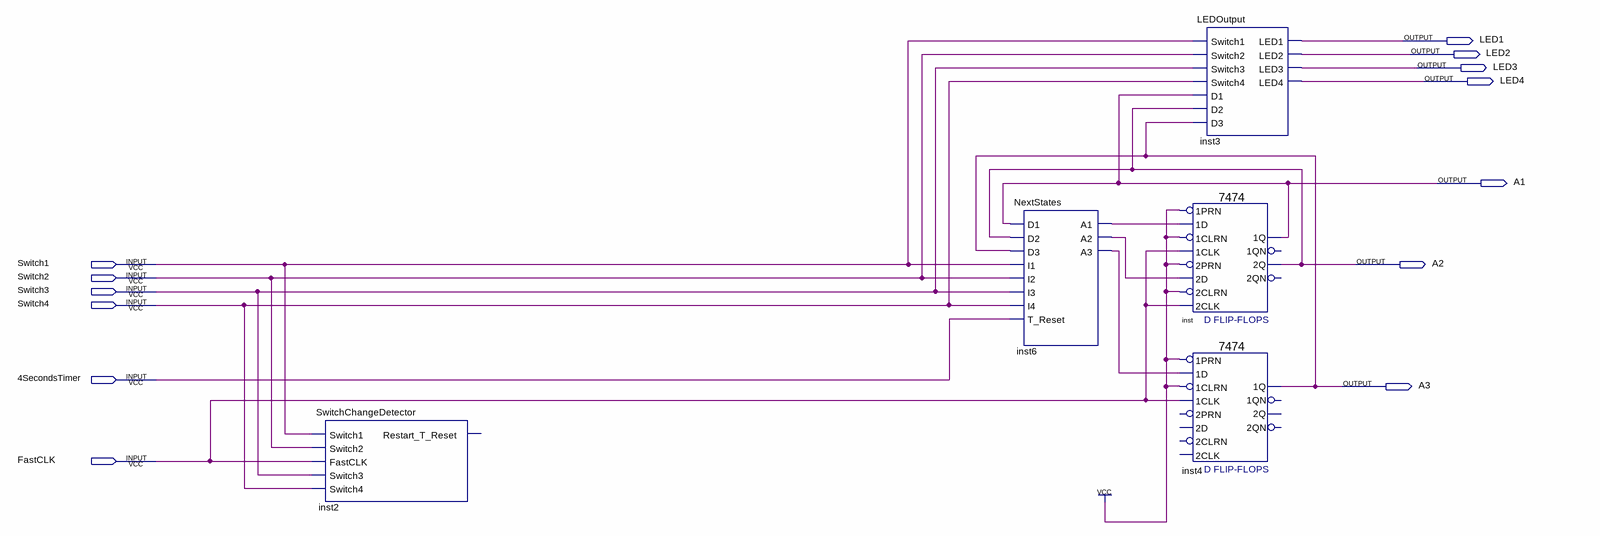
[diagram p0: schematic sheet]
// Quartus schematic ProjectQuartus.bdf as structural Verilog: 5 symbols, 13 pins
module ProjectQuartus (
  input  Switch1,
  input  Switch2,
  input  Switch3,
  input  Switch4,
  input  \4SecondsTimer ,
  input  FastCLK,
  output LED1,
  output LED2,
  output LED3,
  output LED4,
  output A1,
  output A2,
  output A3
);

  wire inst6_a1, inst6_a2, inst6_a3;

  SwitchChangeDetector inst2 (
    .Switch1(Switch1), .Switch2(Switch2), .FastCLK(FastCLK), .Switch3(Switch3), .Switch4(Switch4));  // open: Restart_T_Reset
  NextStates inst6 (
    .D1(A1), .D2(A2), .D3(A3), .I1(Switch1), .I2(Switch2), .I3(Switch3), .I4(Switch4),
    .T_Reset(\4SecondsTimer ), .A1(inst6_a1), .A2(inst6_a2), .A3(inst6_a3));
  LEDOutput inst3 (
    .Switch1(Switch1), .Switch2(Switch2), .Switch3(Switch3), .Switch4(Switch4), .D1(A1), .D2(A2), .D3(A3),
    .LED1(LED1), .LED2(LED2), .LED3(LED3), .LED4(LED4));
  \7474  inst (
    .\2D (inst6_a2), .\2PRN (1'b1), .\1CLK (FastCLK), .\1D (inst6_a1), .\1PRN (1'b1), .\2CLK (FastCLK),
    .\2CLRN (1'b1), .\1CLRN (1'b1), .\2Q (A2), .\1Q (A1));  // open: 1QN, 2QN
  \7474  inst4 (
    .\1CLK (FastCLK), .\1D (inst6_a3), .\1PRN (1'b1), .\1CLRN (1'b1), .\1Q (A3));  // open: 2D, 2PRN, 2CLK, 2CLRN, 1QN, 2Q, 2QN
endmodule
